# Altium schematic sheet MAIN.SchDoc
size B
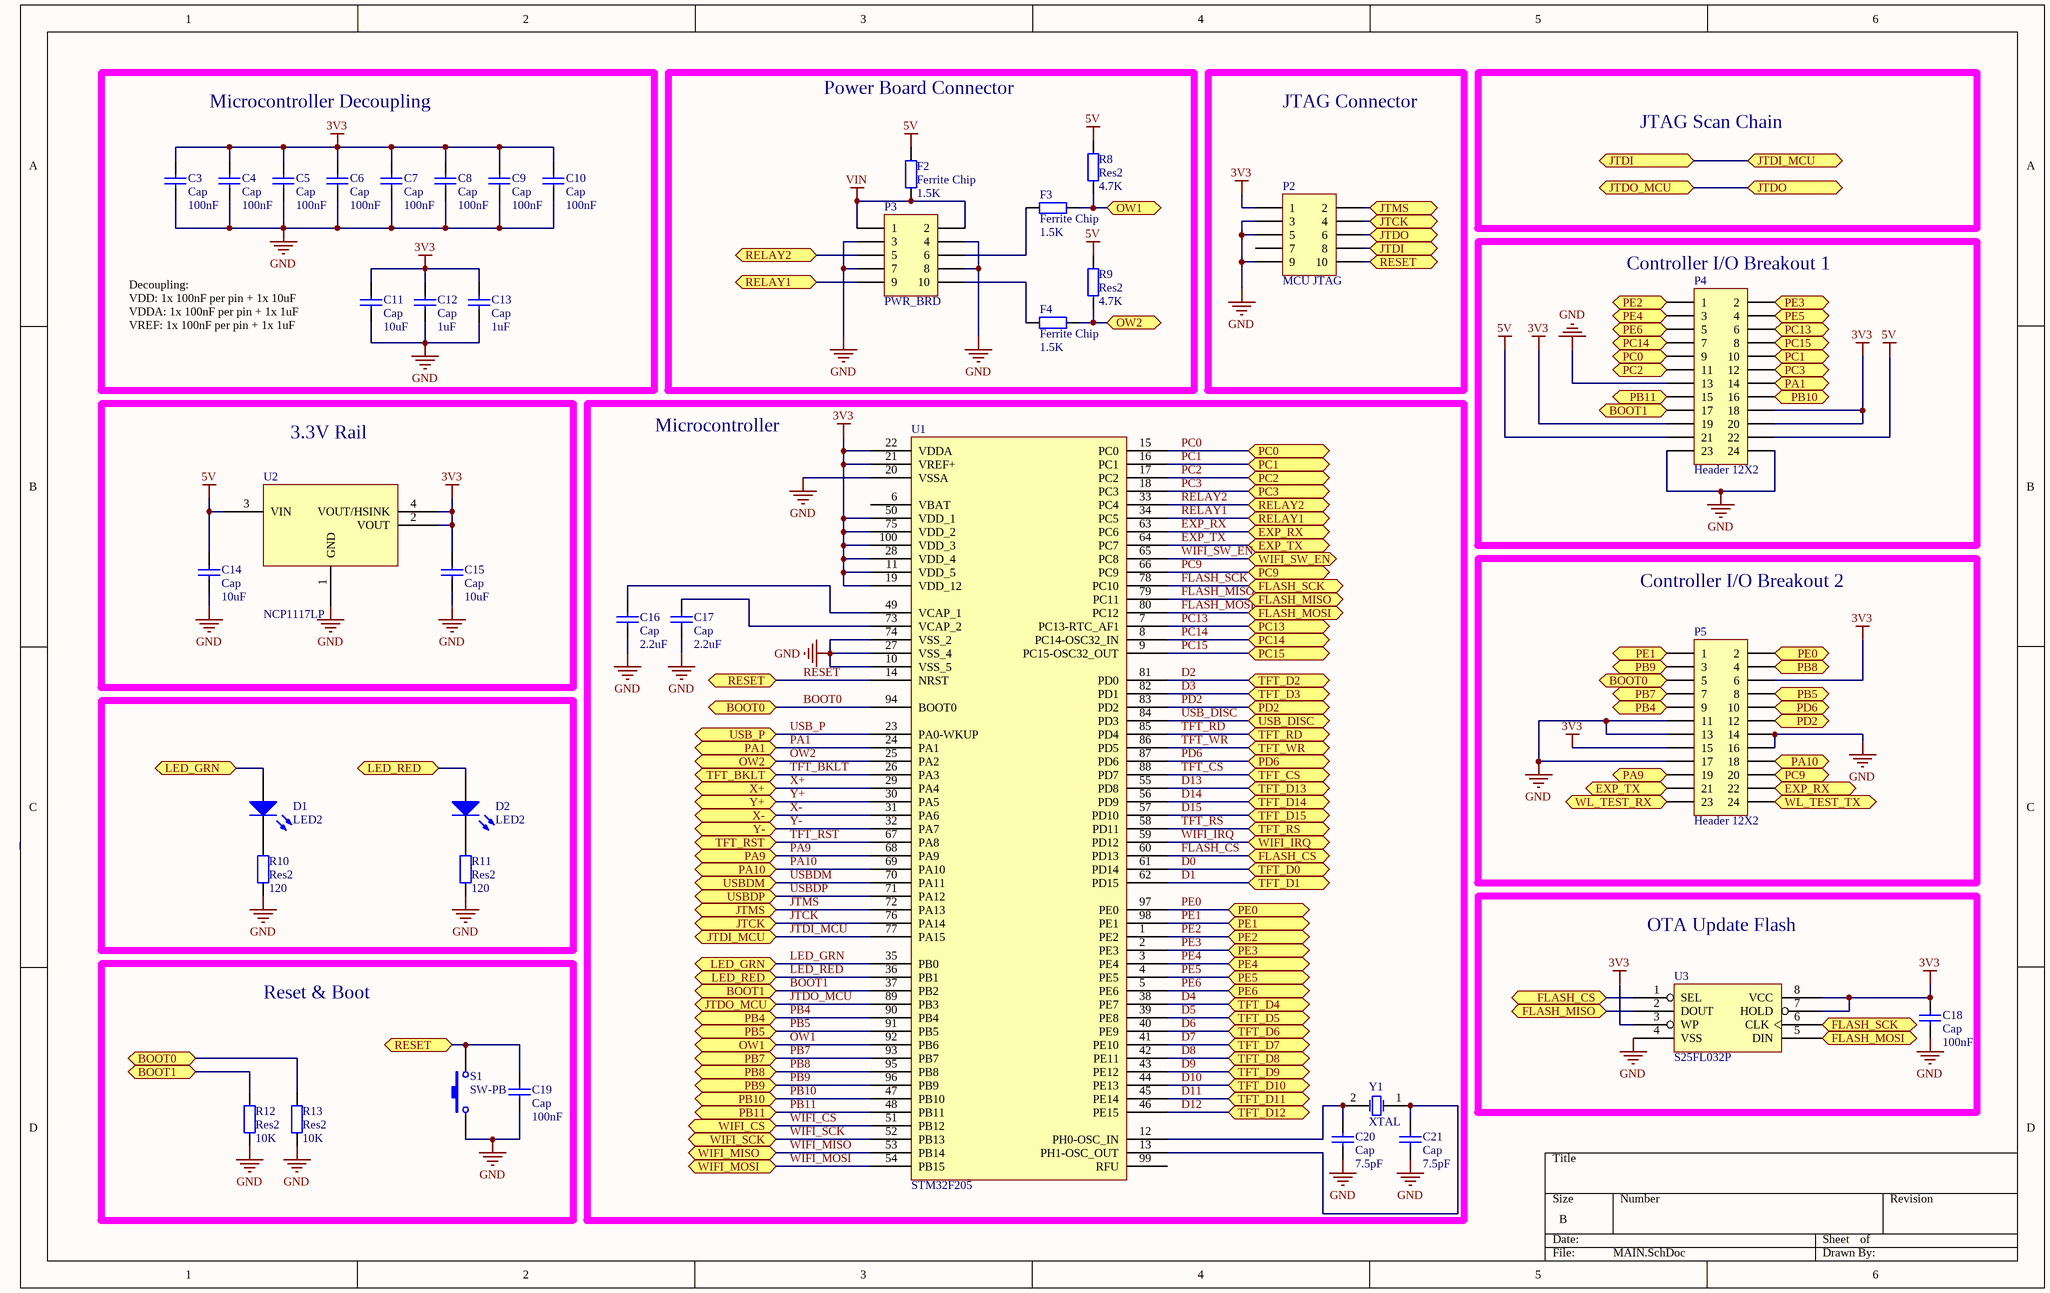
[diagram p0: MAIN.SchDoc]

## Parts
C3  Cap  value 100nF  [0603]
C4  Cap  value 100nF  [0603]
C5  Cap  value 100nF  [0603]
C6  Cap  value 100nF  [0603]
C7  Cap  value 100nF  [0603]
C8  Cap  value 100nF  [0603]
C9  Cap  value 100nF  [0603]
C10  Cap  value 100nF  [0603]
C11  Cap  value 10uF  [0805]
C12  Cap  value 1uF  [0603]
C13  Cap  value 1uF  [0603]
C14  Cap  value 10uF  [0805]
C15  Cap  value 10uF  [0805]
C16  Cap  value 2.2uF  [0603]
C17  Cap  value 2.2uF  [0603]
C18  Cap  value 100nF  [0603]
C19  Cap  value 100nF  [0603]
C20  Cap  value 7.5pF  [0603]
C21  Cap  value 7.5pF  [0603]
D1  LED2  [0603]
D2  LED2  [0603]
F2  Ferrite Chip  value 1.5K  [0603]
F3  Ferrite Chip  value 1.5K  [0603]
F4  Ferrite Chip  value 1.5K  [0603]
P2  MCU JTAG  [JTAG PTH]
P3  PWR_BRD  [HDR2X5]
P4  Header 12X2  [HDR2X12]
P5  Header 12X2  [HDR2X12]
R8  Res2  value 4.7K  [0603]
R9  Res2  value 4.7K  [0603]
R10  Res2  value 120  [0603]
R11  Res2  value 120  [0603]
R12  Res2  value 10K  [0603]
R13  Res2  value 10K  [0603]
S1  SW-PB  [FSM4JSMA]
U1  STM32F205  [LQFP-100]
U2  NCP1117LP  [SOT-223]
U3  S25FL032P  [SOC008]
Y1  XTAL  [HC49SD XTAL]

## Blocks framed on the sheet
Microcontroller Decoupling: C3-C13
Power Board Connector: F2-F4 P3 R8 R9
JTAG Connector: P2
Controller I/O Breakout 1: P4
3.3V Rail: C14 C15 U2
Microcontroller: C16 C17 C20 C21 U1 Y1
Controller I/O Breakout 2: P5
OTA Update Flash: C18 U3
Reset & Boot: C19 R12 R13 S1

## Ports
BOOT0, BOOT1, EXP_RX, EXP_TX, FLASH_CS, FLASH_MISO, FLASH_MOSI, FLASH_SCK, JTCK, JTDI, JTDI_MCU, JTDO, JTDO_MCU, JTMS, LED_GRN, LED_RED, OW1, OW2, PA1, PA9, PA10, PB4, PB5, PB7, PB8, PB9, PB10, PB11, PC0, PC1, PC2, PC3, PC9, PC13, PC14, PC15, PD2, PD6, PE0, PE1, PE2, PE3, PE4, PE5, PE6, RELAY1, RELAY2, RESET, TFT_BKLT, TFT_CS, TFT_D0, TFT_D1, TFT_D2, TFT_D3, TFT_D4, TFT_D5, TFT_D6, TFT_D7, TFT_D8, TFT_D9, TFT_D10, TFT_D11, TFT_D12, TFT_D13, TFT_D14, TFT_D15, TFT_RD, TFT_RS, TFT_RST, TFT_WR, USB_DISC, USB_P, USBDM, USBDP, WIFI_CS, WIFI_IRQ, WIFI_MISO, WIFI_MOSI, WIFI_SCK, WIFI_SW_EN, WL_TEST_RX, WL_TEST_TX, X+, X-, Y+, Y-

## Nets
3V3: C3.2 C4.2 C5.2 C6.2 C7.2 C8.2 C9.2 C10.2 C11.2 C12.2 C13.2 C15.2 C18.2 P2.1 P4.18 P4.19 P4.20 P5.6 P5.15 U1.11(VDD_5) U1.19(VDD_12) U1.21(VREF+) U1.22(VDDA) U1.28(VDD_4) U1.50(VDD_1) U1.75(VDD_2) U1.100(VDD_3) U2.2(VOUT) U2.4(VOUT/HSINK) U3.3(WP) U3.7(HOLD) U3.8(VCC)
5V: C14.2 F2.2 P4.21 P4.22 R8.2 R9.2 U2.3(VIN)
GND: C3.1 C4.1 C5.1 C6.1 C7.1 C8.1 C9.1 C10.1 C11.1 C12.1 C13.1 C14.1 C15.1 C16.1 C17.1 C18.1 C19.1 C20.1 C21.1 P2.3 P2.5 P2.9 P3.3 P3.4 P3.7 P3.8 P4.13 P4.23 P4.24 P5.11 P5.13 P5.14 P5.16 P5.17 R10.1 R11.1 R12.1 R13.1 S1.1 U1.10(VSS_5) U1.20(VSSA) U1.27(VSS_4) U1.74(VSS_2) U2.1(GND) U3.4(VSS)
VIN: F2.1 P3.1 P3.2
BOOT0: P5.5 R13.2 U1.94(BOOT0) ; port BOOT0
BOOT1: P4.17 R12.2 U1.37(PB2) ; port BOOT1
D0: U1.61(PD14) ; port TFT_D0
D1: U1.62(PD15) ; port TFT_D1
D2: U1.81(PD0) ; port TFT_D2
D3: U1.82(PD1) ; port TFT_D3
D4: U1.38(PE7) ; port TFT_D4
D5: U1.39(PE8) ; port TFT_D5
D6: U1.40(PE9) ; port TFT_D6
D7: U1.41(PE10) ; port TFT_D7
D8: U1.42(PE11) ; port TFT_D8
D9: U1.43(PE12) ; port TFT_D9
D10: U1.44(PE13) ; port TFT_D10
D11: U1.45(PE14) ; port TFT_D11
D12: U1.46(PE15) ; port TFT_D12
D13: U1.55(PD8) ; port TFT_D13
D14: U1.56(PD9) ; port TFT_D14
D15: U1.57(PD10) ; port TFT_D15
EXP_RX: P5.22 U1.63(PC6) ; port EXP_RX
EXP_TX: P5.21 U1.64(PC7) ; port EXP_TX
FLASH_CS: U1.60(PD13) U3.1(SEL) ; port FLASH_CS
FLASH_MISO: U1.79(PC11) U3.2(DOUT) ; port FLASH_MISO
FLASH_MOSI: U1.80(PC12) U3.5(DIN) ; port FLASH_MOSI
FLASH_SCK: U1.78(PC10) U3.6(CLK) ; port FLASH_SCK
JTCK: P2.4 U1.76(PA14) ; port JTCK
JTDI_MCU: P2.8 U1.77(PA15) ; port JTDI, port JTDI_MCU
JTDO_MCU: P2.6 U1.89(PB3) ; port JTDO, port JTDO_MCU
JTMS: P2.2 U1.72(PA13) ; port JTMS
LED_GRN: D1.1(A) U1.35(PB0) ; port LED_GRN
LED_RED: D2.1(A) U1.36(PB1) ; port LED_RED
OW1: F3.1 R8.1 U1.92(PB6) ; port OW1
OW2: F4.1 R9.1 U1.25(PA2) ; port OW2
PA1: P4.14 U1.24(PA1) ; port PA1
PA9: P5.19 U1.68(PA9) ; port PA9
PA10: P5.18 U1.69(PA10) ; port PA10
PB4: P5.9 U1.90(PB4) ; port PB4
PB5: P5.8 U1.91(PB5) ; port PB5
PB7: P5.7 U1.93(PB7) ; port PB7
PB8: P5.4 U1.95(PB8) ; port PB8
PB9: P5.3 U1.96(PB9) ; port PB9
PB10: P4.16 U1.47(PB10) ; port PB10
PB11: P4.15 U1.48(PB11) ; port PB11
PC0: P4.9 U1.15(PC0) ; port PC0
PC1: P4.10 U1.16(PC1) ; port PC1
PC2: P4.11 U1.17(PC2) ; port PC2
PC3: P4.12 U1.18(PC3) ; port PC3
PC9: P5.20 U1.66(PC9) ; port PC9
PC13: P4.6 U1.7(PC13-RTC_AF1) ; port PC13
PC14: P4.7 U1.8(PC14-OSC32_IN) ; port PC14
PC15: P4.8 U1.9(PC15-OSC32_OUT) ; port PC15
PD2: P5.12 U1.83(PD2) ; port PD2
PD6: P5.10 U1.87(PD6) ; port PD6
PE0: P5.2 U1.97(PE0) ; port PE0
PE1: P5.1 U1.98(PE1) ; port PE1
PE2: P4.1 U1.1(PE2) ; port PE2
PE3: P4.2 U1.2(PE3) ; port PE3
PE4: P4.3 U1.3(PE4) ; port PE4
PE5: P4.4 U1.4(PE5) ; port PE5
PE6: P4.5 U1.5(PE6) ; port PE6
RELAY1: P3.9 U1.34(PC5) ; port RELAY1
RELAY2: P3.5 U1.33(PC4) ; port RELAY2
RESET: C19.2 P2.10 S1.2 U1.14(NRST) ; port RESET
TFT_BKLT: U1.26(PA3) ; port TFT_BKLT
TFT_CS: U1.88(PD7) ; port TFT_CS
TFT_RD: U1.85(PD4) ; port TFT_RD
TFT_RS: U1.58(PD11) ; port TFT_RS
TFT_RST: U1.67(PA8) ; port TFT_RST
TFT_WR: U1.86(PD5) ; port TFT_WR
USB_DISC: U1.84(PD3) ; port USB_DISC
USB_P: U1.23(PA0-WKUP) ; port USB_P
USBDM: U1.70(PA11) ; port USBDM
USBDP: U1.71(PA12) ; port USBDP
WIFI_CS: U1.51(PB12) ; port WIFI_CS
WIFI_IRQ: U1.59(PD12) ; port WIFI_IRQ
WIFI_MISO: U1.53(PB14) ; port WIFI_MISO
WIFI_MOSI: U1.54(PB15) ; port WIFI_MOSI
WIFI_SCK: U1.52(PB13) ; port WIFI_SCK
WIFI_SW_EN: U1.65(PC8) ; port WIFI_SW_EN
WL_TEST_RX: P5.23 ; port WL_TEST_RX
WL_TEST_TX: P5.24 ; port WL_TEST_TX
X+: U1.29(PA4) ; port X+
X-: U1.31(PA6) ; port X-
Y+: U1.30(PA5) ; port Y+
Y-: U1.32(PA7) ; port Y-
NetC16_2: C16.2 U1.49(VCAP_1)
NetC17_2: C17.2 U1.73(VCAP_2)
NetC20_2: C20.2 U1.12(PH0-OSC_IN) Y1.2(OSC2)
NetC21_2: C21.2 U1.13(PH1-OSC_OUT) Y1.1(OSC1)
NetD1_2: D1.2(K) R10.2
NetD2_2: D2.2(K) R11.2
NetF3_2: F3.2 P3.6
NetF4_2: F4.2 P3.10

Not connected (* = marked no-connect by the designer): P2 7; U1 6(VBAT) 99(RFU)

## Notes on the sheet
- JTAG Scan Chain
- Decoupling:
  VDD: 1x 100nF per pin + 1x 10uF
  VDDA: 1x 100nF per pin + 1x 1uF
  VREF: 1x 100nF per pin + 1x 1uF

## Library data of the parts
C3-C21 = Cap: Capacitor; Supplier 1: Digi-Key
  C3-C10 C18 C19: Supplier Part Number 1: 399-1095-1-ND
  C11 C14 C15: Supplier Part Number 1: 445-6857-1-ND
  C12 C13: Supplier Part Number 1: 587-1242-1-ND
  C16 C17: Supplier Part Number 1: 587-2983-1-ND
  C20 C21: Supplier Part Number 1: 490-3565-1-ND
D1 D2 = LED2: Typical RED, GREEN, YELLOW, AMBER GaAs LED; Supplier 1: Digi-Key
  D1: Supplier Part Number 1: 160-1183-1-ND
  D2: Supplier Part Number 1: 160-1181-1-ND
F2-F4 = Res2: Supplier 1: Digi-Key; Supplier Part Number 1: 490-5216-1-ND
P2 P3 = Header 5X2: Header, 5-Pin, Dual row; Supplier 1: Digi-Key
  P2: Supplier Part Number 1: 609-3712-ND
  P3: Supplier Part Number 1: ED1543-ND
P4 P5 = Header 12X2: Header, 12-Pin, Dual row; Supplier 1: Digi-Key
R8-R13 = Res2: Resistor; Supplier 1: Digi-Key
  R8 R9: Supplier Part Number 1: 311-4.7KGRCT-ND
  R10 R11: Supplier Part Number 1: P120GCT-ND
  R12 R13: Supplier Part Number 1: P10KGCT-ND
S1 = SW-PB: Switch; Supplier Part Number 1: 450-1759-1-ND; Supplier 1: Digi-Key
U1 = STM32F20x-LQFP100: STMicroelectronics STM32F20x LQFP100; Supplier 1: Digi-Key; Supplier Part Number 1: 497-11161-ND
U2 = NCP1117LP: 1.0 A Low-Dropout Positive  Fixed and Adjustable  Voltage Regulators; Supplier 1: Digi-Key; Supplier Part Number 1: NCP1117LPST33T3GOSCT-ND
U3 = M25P80-VMN6TP: IC FLASH 8MBIT 75MHZ SO8N; Supplier 1: Digi-Key; Supplier Part Number 1: S25FL032P0XMFI011-ND
Y1 = XTAL: Crystal Oscillator; Supplier 1: Digi-Key; Supplier Part Number 1: 631-1010-1-ND